# EAGLE design Fotocelda_01 (EAGLE 8.6.3)
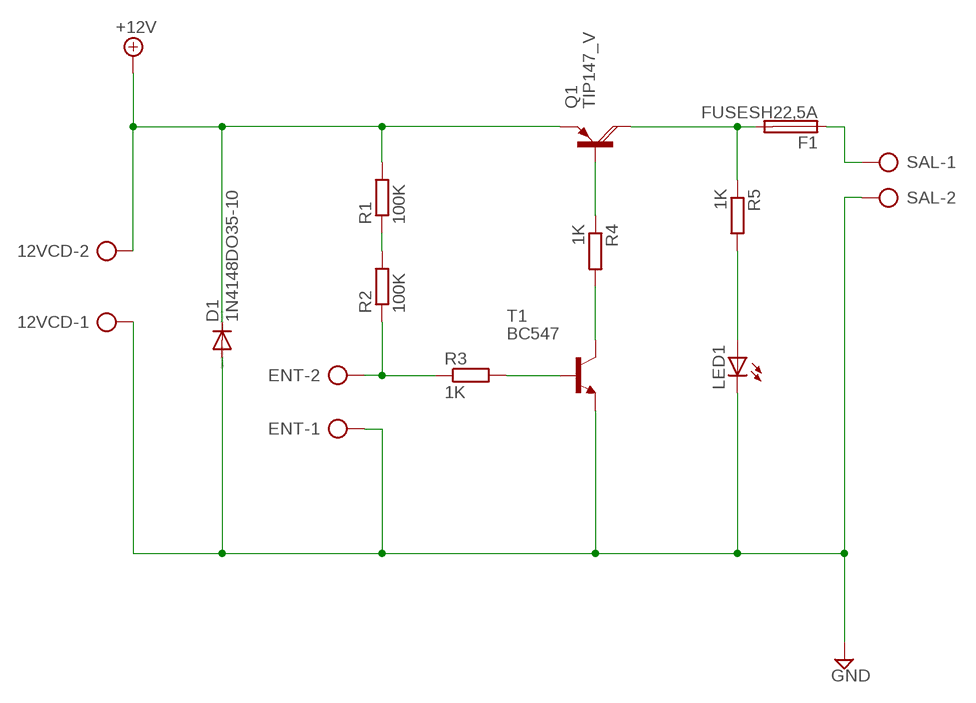
[diagram p0: schematic, sheet 1]

## Parts
12VCD  AK500/2  [AK500/2]
D1  1N4148DO35-10  [DO35-10]
ENT  AK500/2  [AK500/2]
F1  FUSESH22,5A  [SH22,5A]
LED1  LED5MM  [LED5MM]
Q1  TIP147_V  [SOT93V]
R1  100K  R-EU_0207/10  [0207/10]
R2  100K  R-EU_0207/10  [0207/10]
R3  1K  R-EU_0207/10  [0207/10]
R4  1K  R-EU_0207/10  [0207/10]
R5  1K  R-EU_0207/10  [0207/10]
SAL  AK500/2  [AK500/2]
T1  BC547  [TO92]

## Nets
+12V: 12VCD.2 D1.C Q1.E R1.2
GND: 12VCD.1 D1.A ENT.1 LED1.K(C) SAL.2 T1.1(E)
N$1: F1.1 SAL.1
N$2: R1.1 R2.2
N$3: ENT.2 R2.1 R3.1
N$4: R3.2 T1.2(B)
N$5: R4.2 T1.3(C)
N$6: Q1.B R4.1
N$7: F1.2 Q1.C R5.1
N$8: LED1.A R5.2

## Library data of the parts
12VCD ENT SAL = con-ptr500:AK500/2: CONNECTOR; OC_FARNELL: unknown; OC_NEWARK: unknown
D1 = diode:1N4148: DIODE high speed (Philips)
F1 = fuse:FUSE: Fuse; OC_FARNELL: unknown; OC_NEWARK: unknown
LED1 = led:LED: LED OSRAM: - CHIPLED LG R971, LG N971, LY N971, LG Q971, LY Q971, LO R971, LY R971 LH N974, LH R974 LS Q976, LO Q976, LY Q976 LO Q996 - Hyper CHIPLED LW Q18S LB Q993, LB Q99A, LB R99A - SideLED LS A670, LO A670, LY A670, LG A670, LP A670 LB A673, LV A673, LT A673, LW A673 LH A674 LY A675 LS A676, LA A676, LO A676, LY A676, LW A676 LS A679, LY A679, LG A679 - Hyper Micro SIDELED® LS Y876, LA Y876, LO Y876, LY Y876 LT Y87S - SmartLED LW L88C, LW L88S LB L89C, LB L89S, LG L890 LS L89K, LO L89K, LY L89K LS L896, LA L896, LO L896, LY L896 - TOPLED LS T670, LO T670, LY T670, LG T670, LP T670 LSG T670, LSP T670, LSY T670, LOP T670, LYG T670 LG T671, LOG T671, LSG T671 LB T673, LV T673, LT T673, LW T673 LH T674 LS T676, LA T676, LO T676, LY T676, LB T676, LH T676, LSB T676, LW T676 LB T67C, LV T67C, LT T67C, LS T67K, LO T67K, LY T67K, LW E67C LS E67B, LA E67B, LO E67B, LY E67B, LB E67C, LV E67C, LT E67C LW T67C LS T679, LY T679, LG T679 LS T770, LO T770, LY T770, LG T770, LP T770 LB T773, LV T773, LT T773, LW T773 LH T774 LS E675, LA E675, LY E675, LS T675 LS T776, LA T776, LO T776, LY T776, LB T776 LHGB T686 LT T68C, LB T68C - Hyper Mini TOPLED® LB M676 - Mini TOPLED Santana® LG M470 LS M47K, LO M47K, LY M47K Source: http://www.osram.convergy.de LUXEON: - LUMILED® LXK2-PW12-R00, LXK2-PW12-S00, LXK2-PW14-U00, LXK2-PW14-V00 LXK2-PM12-R00, LXK2-PM12-S00, LXK2-PM14-U00 LXK2-PE12-Q00, LXK2-PE12-R00, LXK2-PE12-S00, LXK2-PE14-T00, LXK2-PE14-U00 LXK2-PB12-K00, LXK2-PB12-L00, LXK2-PB12-M00, LXK2-PB14-N00, LXK2-PB14-P00, LXK2-PB14-Q00 LXK2-PR12-L00, LXK2-PR12-M00, LXK2-PR14-Q00, LXK2-PR14-R00 LXK2-PD12-Q00, LXK2-PD12-R00, LXK2-PD12-S00 LXK2-PH12-R00, LXK2-PH12-S00 LXK2-PL12-P00, LXK2-PL12-Q00, LXK2-PL12-R00 Source: www.luxeon.com KINGBRIGHT: KA-3528ASYC Source: www.kingbright.com
Q1 = transistor-power:TIP147_V
R1-R5 = rcl:R-EU_: RESISTOR, European symbol; SPICEPREFIX: R
T1 = transistor:BC547: NPN TRANSISTOR

## Board
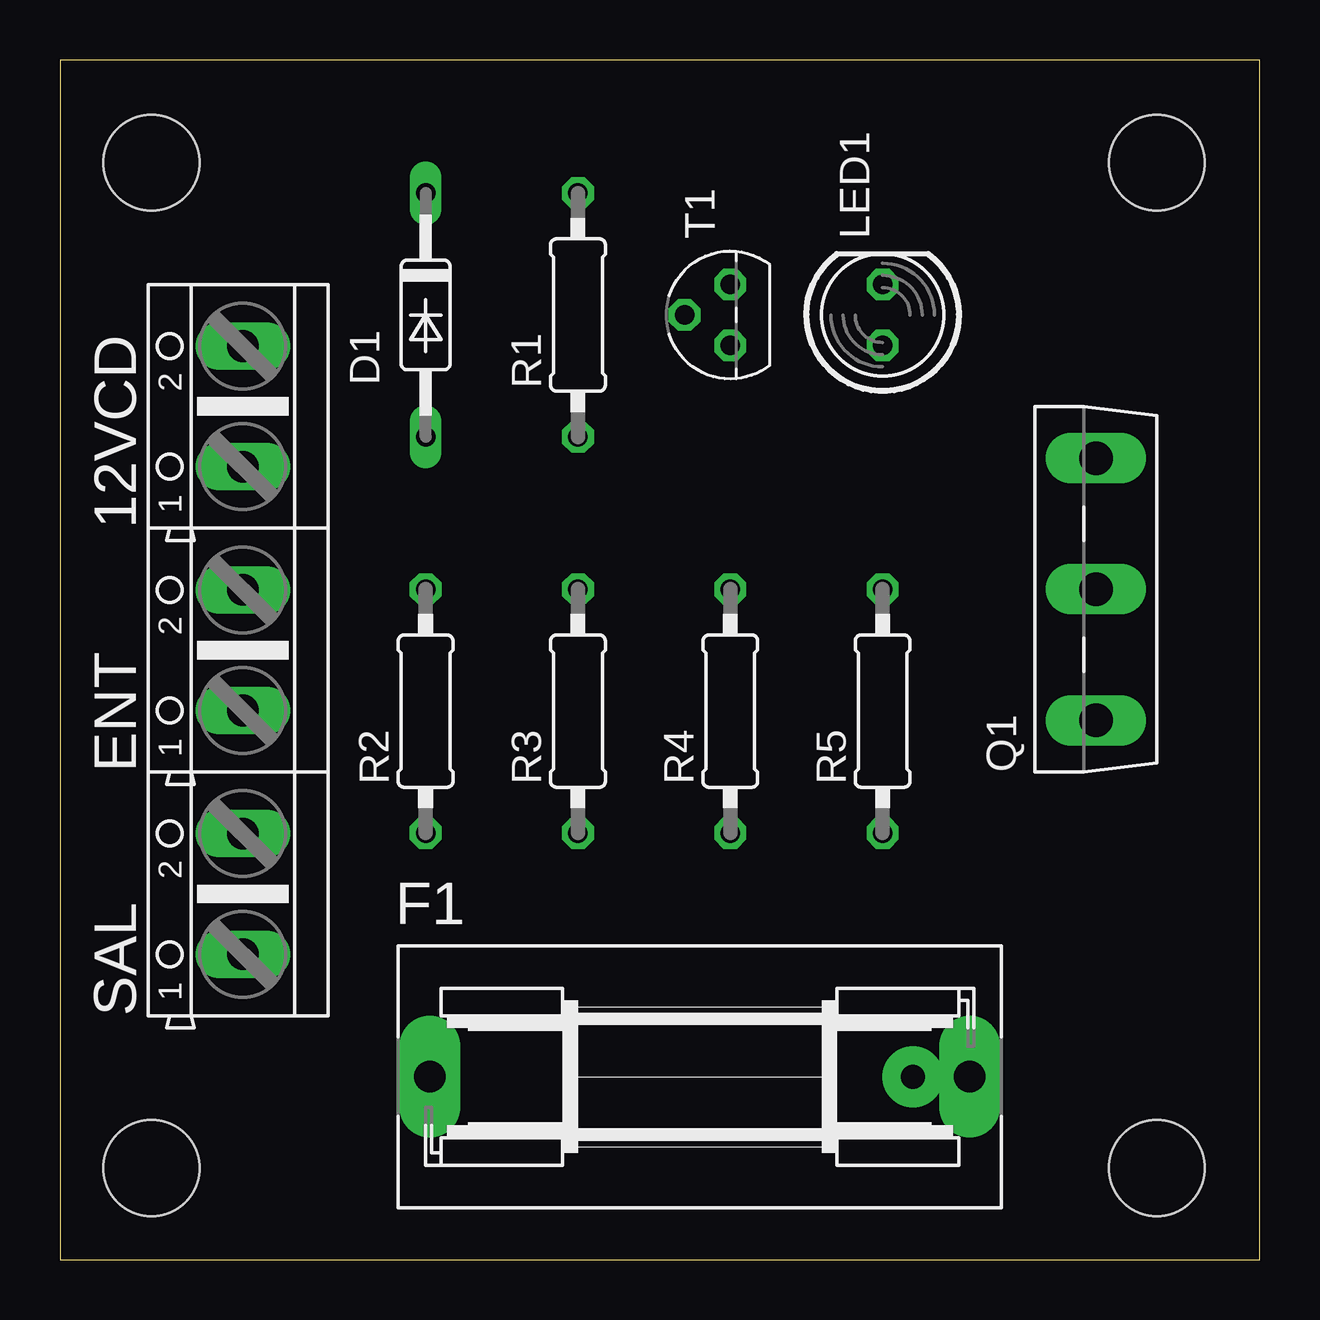
[diagram p1: board, top side]
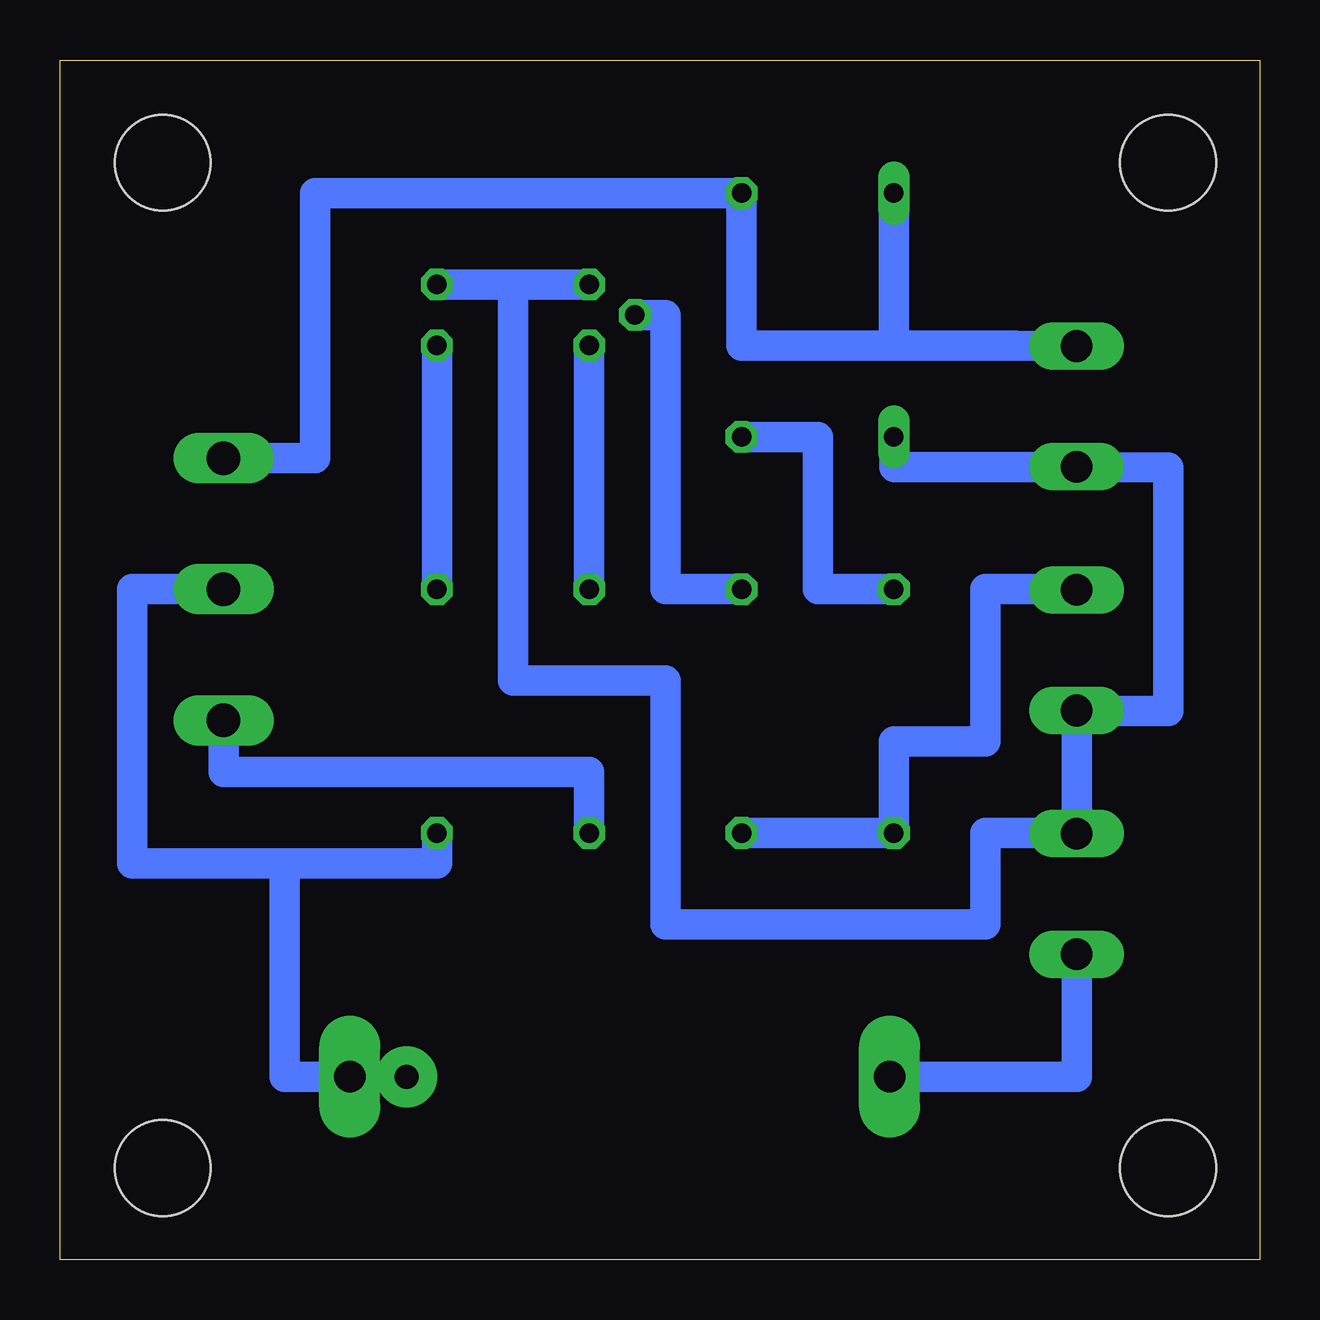
[diagram p2: board, bottom side, seen from below]

Size 50 x 50 mm. Coordinates in mm from the lower left corner, seen from the top.
Outline: 0,0 50,0 50,50 0,50 0,0
Copper layers (1*16): Top 0.035mm / dielectric 1.5mm / Bottom 0.035mm
Design rules "default": minimum track width 6mil, minimum drill 0.35mm, track to track 6mil, track to pad 6mil, pad to pad 6mil, via to via 6mil, smd to smd 6mil, copper to edge 40mil, drill to drill 6mil, minimum pad ring 10mil, minimum via ring 8mil, stop-mask expansion 4mil, vias tented up to drill 0mil, thermal gap 10mil
Holes 4 mm at 3.81,45.72 45.72,45.72 3.81,3.81 45.72,3.81

### Footprints (pad centres in the part's own frame; a part is rotated, then mirrored left to right if it is on the bottom)
AK500/2 = drill 1.321 long: 1 -2.515,0; 2 2.515,0
DO35-10 = drill 0.813 long: A 5.08,0; C -5.08,0
SH22,5A = drill 1.321 pad 2.54 long: 1 -11.252,0; 2 11.252,0
LED5MM = drill 0.813 octagon: A -1.27,0; K 1.27,0
SOT93V = drill 1.397 long: B -5.461,-2.54; C 0,-2.54; E 5.461,-2.54
0207/10 = drill 0.813 octagon: 1 -5.08,0; 2 5.08,0
TO92 = drill 0.813 octagon: 1 1.27,0; 2 0,1.905; 3 -1.27,0

### Placement (x,y rotation side)
12VCD  7.62,35.56 90 top
D1  15.24,39.37 270 top
ENT  7.62,25.4 90 top
F1  26.67,7.62 0 top
LED1  34.29,39.37 90 top
Q1  40.64,27.94 90 top
R1  21.59,39.37 90 top
R2  15.24,22.86 90 top
R3  21.59,22.86 90 top
R4  27.94,22.86 90 top
R5  34.29,22.86 90 top
SAL  7.62,15.24 90 top
T1  27.94,39.37 90 top

### Tracks (layer width: path | path; a pad name or v marks a point on that pad's centre or on a via)
+12V
  Bottom 1.27: 12VCD.2 10.19,38.1 15.24,38.1 | 15.24,38.1 21.59,38.1 R1.2 39.37,44.45 39.37,33.4 Q1.E | D1.C 15.24,38.1
GND
  Bottom 1.27: 12VCD.1 7.63,33.03 | 7.63,33.03 3.81,33.02 3.81,22.86 7.59,22.86 7.62,22.84 | D1.A 15.23,33.03 7.63,33.03 | LED1.K 31.11,40.64 | 31.11,40.64 T1.1 | 7.62,22.84 SAL.2 | 7.62,17.78 SAL.2 | 31.11,40.64 31.11,24.13 24.77,24.13 24.77,13.97 11.43,13.97 11.43,17.78 7.64,17.78 SAL.2 | ENT.1 7.62,22.84
N$1
  Bottom 1.27: F1.1 7.62,7.62 SAL.1
N$2
  Bottom 1.27: R1.1 18.41,34.29 18.41,27.94 R2.2
N$3
  Bottom 1.27: R3.1 R2.1 15.24,21.59 11.43,21.59 11.43,27.94 8.91,27.94 ENT.2
N$4
  Bottom 1.27: R3.2 24.77,27.94 24.77,39.37 T1.2
N$5
  Bottom 1.27: R4.2 T1.3
N$6
  Bottom 1.27: R4.1 27.94,20.32 43.18,20.32 Q1.B
N$7  (via drill 1 pad 2.54)
  Bottom 1.27: Q1.C 46.99,27.94 46.99,16.51 40.64,16.51 | R5.1 34.29,16.51 40.64,16.51 | 40.64,16.51 40.64,7.62 F1.2 v35.56,7.62
N$8
  Bottom 1.27: LED1.A R5.2